# EAGLE design ssdf (EAGLE 9.5.2)
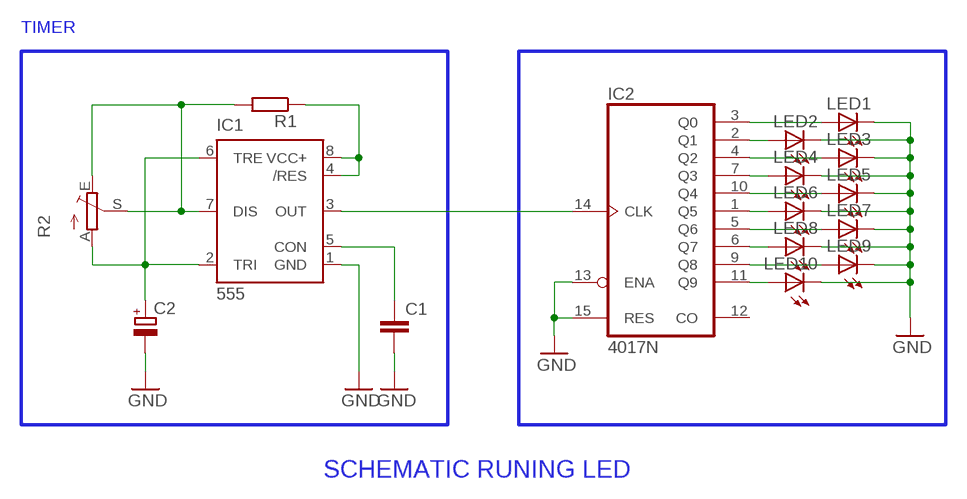
[diagram p0: schematic, sheet 1]

## Parts
C1  C-EU050-025X075  [C050-025X075]
C2  CPOL-EUE2-5  [E2-5]
IC1  555  555KIT  [DIP08-KIT]
IC2  4017N  [DIL16]
LED1  LED3MM  [LED3MM]
LED2  LED3MM  [LED3MM]
LED3  LED3MM  [LED3MM]
LED4  LED3MM  [LED3MM]
LED5  LED3MM  [LED3MM]
LED6  LED3MM  [LED3MM]
LED7  LED3MM  [LED3MM]
LED8  LED3MM  [LED3MM]
LED9  LED3MM  [LED3MM]
LED10  LED3MM  [LED3MM]
R1  R-EU_0204/7  [0204/7]
R2  TRIM_EU-B25P  [B25P]

## Nets
GND: C1.2 C2.- IC1.1(GND) IC2.13(ENA) IC2.15(RES) LED1.K(C) LED2.K(C) LED3.K(C) LED4.K(C) LED5.K(C) LED6.K(C) LED7.K(C) LED8.K(C) LED9.K(C) LED10.K(C)
N$1: C2.+ IC1.2(TRI) IC1.6(TRE) R2.A
N$2: C1.1 IC1.5(CON)
N$3: IC1.4(/RES) IC1.8(VCC+) R1.1
N$4: IC1.7(DIS) R1.2 R2.E R2.S
N$5: IC2.3(Q0) LED1.A
N$6: IC2.2(Q1) LED2.A
N$7: IC2.4(Q2) LED3.A
N$8: IC2.7(Q3) LED4.A
N$9: IC2.10(Q4) LED5.A
N$10: IC2.1(Q5) LED6.A
N$11: IC2.5(Q6) LED7.A
N$12: IC2.6(Q7) LED8.A
N$13: IC2.9(Q8) LED9.A
N$14: IC2.11(Q9) LED10.A
N$15: IC1.3(OUT) IC2.14(CLK)
Unconnected: IC2.12(CO)

## Notes on the sheet
- TIMER
- SCHEMATIC RUNING LED

## Power pins joined to a net without a drawn wire
VDD: IC2.16(VDD)
VSS: IC2.8(VSS)

## Library data of the parts
C1 = rcl:C-EU: CAPACITOR, European symbol; SPICEPREFIX: C
C2 = rcl:CPOL-EU: POLARIZED CAPACITOR, European symbol; SPICEPREFIX: C
IC1 = SparkFun-IC-Special-Function:555: General purpose bipolar Timer Datasheet <http://www.sparkfun.com/datasheets/Components/General/ne555.pdf> SparkFun Products SparkFun SparkPunk Sequencer Kit <https://www.sparkfun.com/products/12707> (KIT-12707) Storefront Component: 555 Timer <https://www.sparkfun.com/products/9273> (COM-09273) Two parts valid for production: VFP: IC-11930 (M7555 PTH) VFP: IC-09173 (555 PTH) - Preferred; PROD_ID: IC-09173; PROD_ID_ALT: IC-11930
IC2 = 40xx:4017: COUNTER/DIVIDER
LED1-LED10 = adafruit:LED: LED OSRAM: - CHIPLED LG R971, LG N971, LY N971, LG Q971, LY Q971, LO R971, LY R971 LH N974, LH R974 LS Q976, LO Q976, LY Q976 LO Q996 - Hyper CHIPLED LW Q18S LB Q993, LB Q99A, LB R99A - SideLED LS A670, LO A670, LY A670, LG A670, LP A670 LB A673, LV A673, LT A673, LW A673 LH A674 LY A675 LS A676, LA A676, LO A676, LY A676, LW A676 LS A679, LY A679, LG A679 - Hyper Micro SIDELED® LS Y876, LA Y876, LO Y876, LY Y876 LT Y87S - SmartLED LW L88C, LW L88S LB L89C, LB L89S, LG L890 LS L89K, LO L89K, LY L89K LS L896, LA L896, LO L896, LY L896 - TOPLED LS T670, LO T670, LY T670, LG T670, LP T670 LSG T670, LSP T670, LSY T670, LOP T670, LYG T670 LG T671, LOG T671, LSG T671 LB T673, LV T673, LT T673, LW T673 LH T674 LS T676, LA T676, LO T676, LY T676, LB T676, LH T676, LSB T676, LW T676 LB T67C, LV T67C, LT T67C, LS T67K, LO T67K, LY T67K, LW E67C LS E67B, LA E67B, LO E67B, LY E67B, LB E67C, LV E67C, LT E67C LW T67C LS T679, LY T679, LG T679 LS T770, LO T770, LY T770, LG T770, LP T770 LB T773, LV T773, LT T773, LW T773 LH T774 LS E675, LA E675, LY E675, LS T675 LS T776, LA T776, LO T776, LY T776, LB T776 LHGB T686 LT T68C, LB T68C - Hyper Mini TOPLED® LB M676 - Mini TOPLED Santana® LG M470 LS M47K, LO M47K, LY M47K Source: http://www.osram.convergy.de/
R1 = rcl:R-EU_: RESISTOR, European symbol; SPICEPREFIX: R
R2 = pot:TRIM_EU-: POTENTIOMETER

## Board
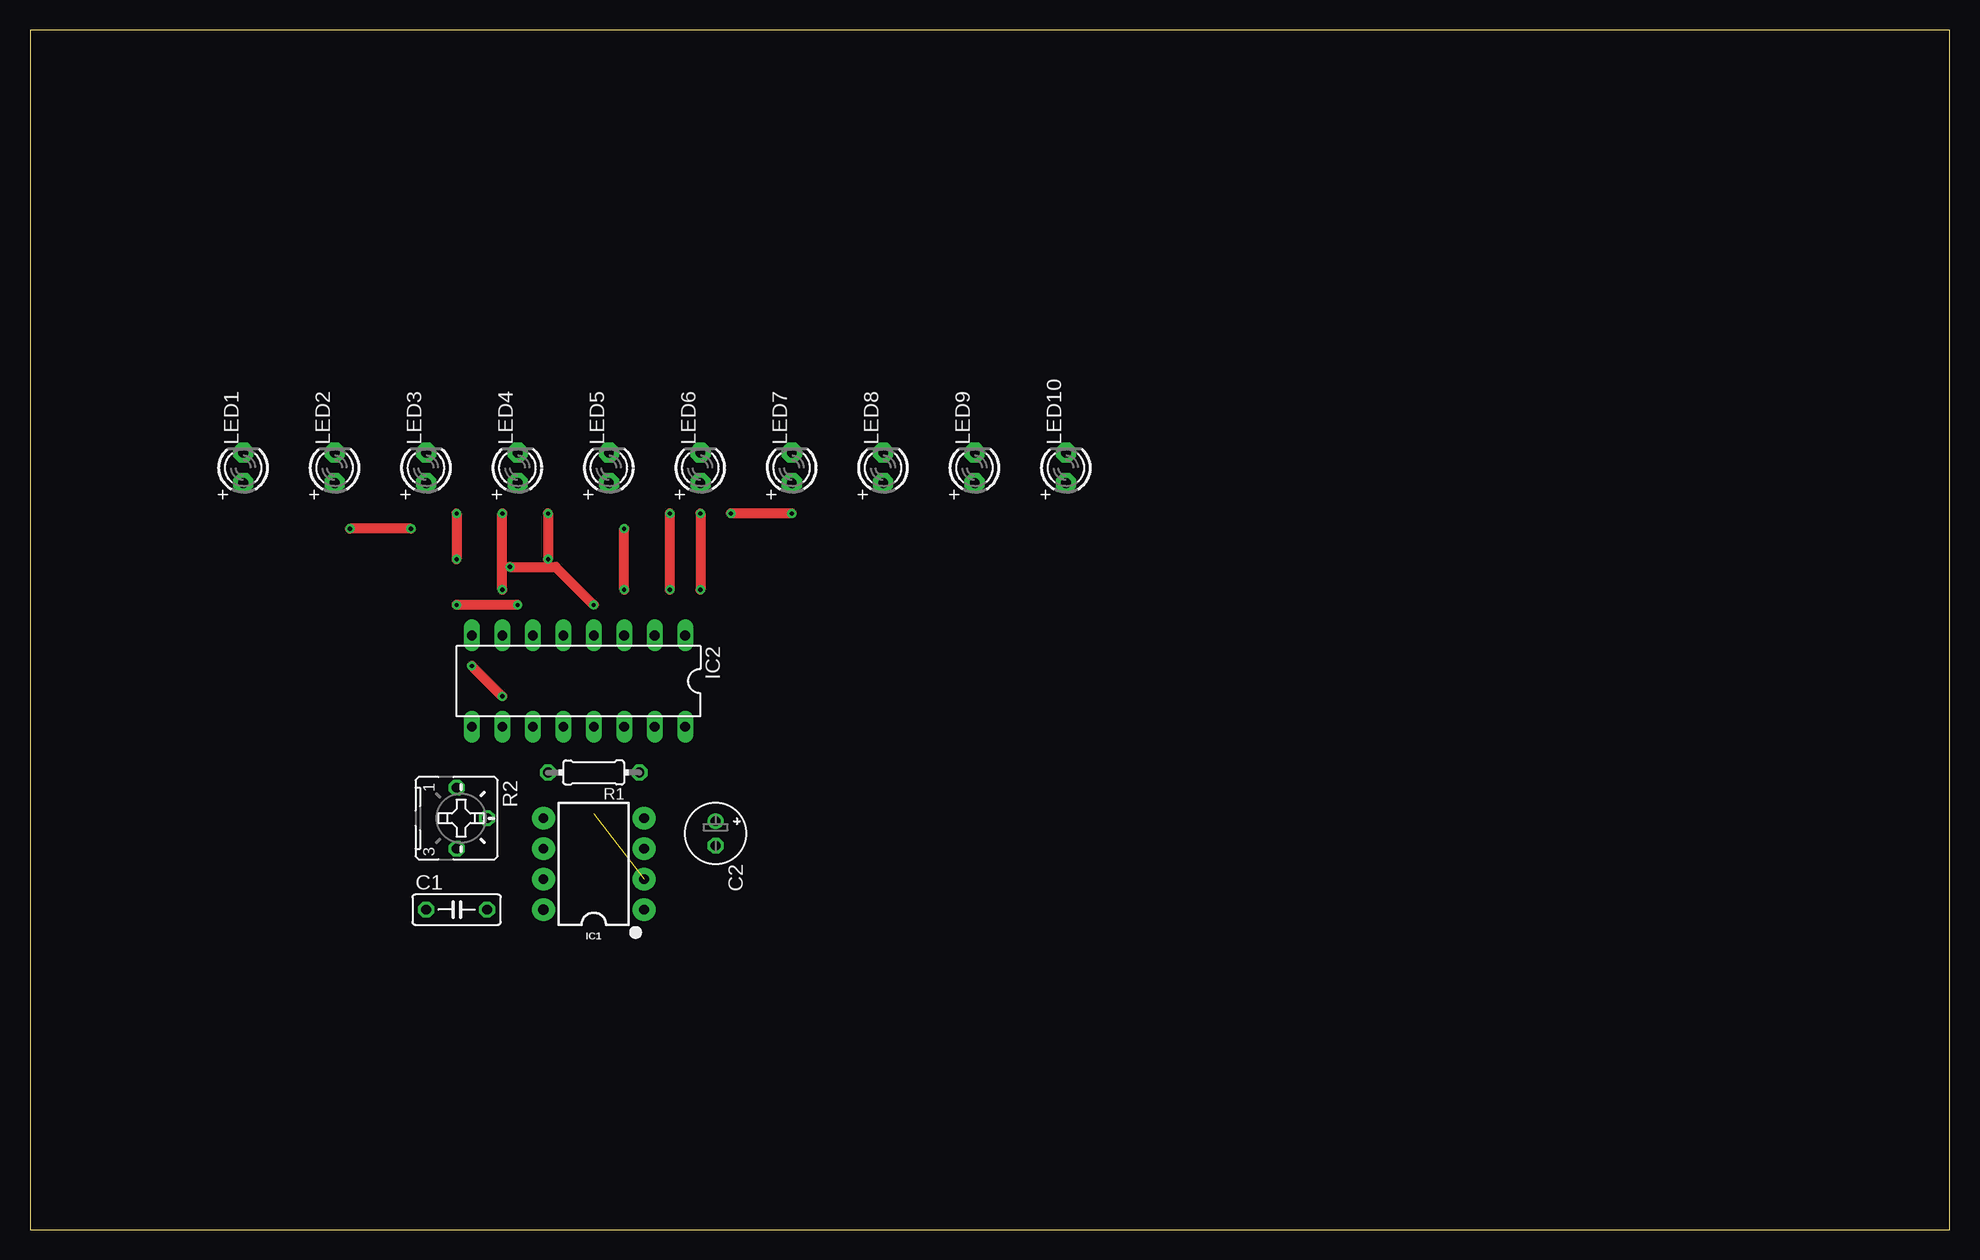
[diagram p1: board, top side]
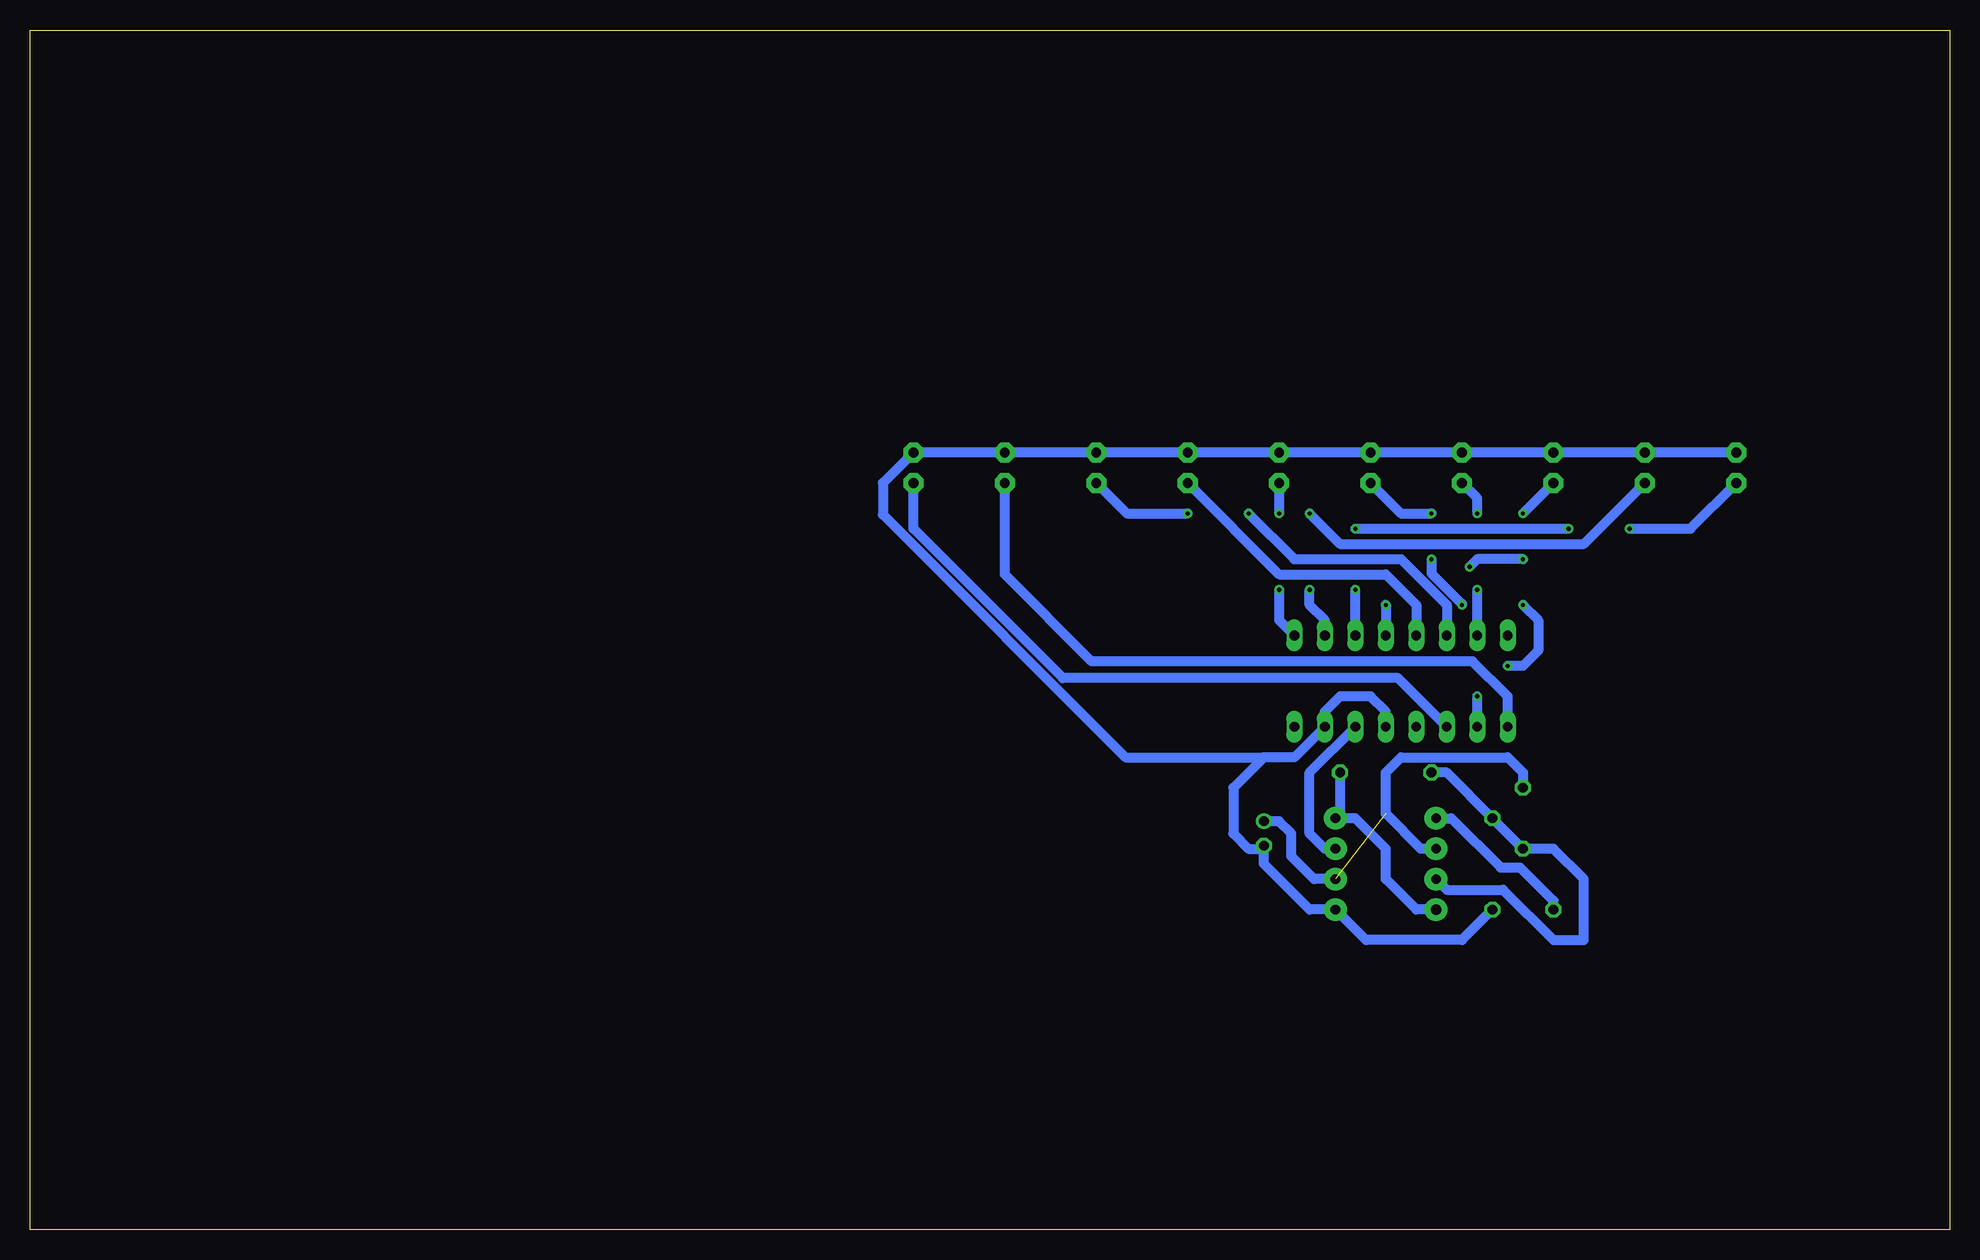
[diagram p2: board, bottom side, seen from below]

Size 160 x 100 mm. Coordinates in mm from the lower left corner, seen from the top.
Outline: 0,0 160,0 160,100 0,100 0,0
Copper layers (1*16): Top 0.035mm / dielectric 1.5mm / Bottom 0.035mm
Design rules "default": minimum track width 6mil, minimum drill 0.35mm, track to track 6mil, track to pad 6mil, pad to pad 6mil, via to via 6mil, smd to smd 6mil, copper to edge 40mil, drill to drill 6mil, minimum pad ring 10mil, minimum via ring 8mil, stop-mask expansion 4mil, vias tented up to drill 0mil, thermal gap 10mil

### Footprints (pad centres in the part's own frame; a part is rotated, then mirrored left to right if it is on the bottom)
C050-025X075 = drill 0.813 octagon: 1 -2.54,0; 2 2.54,0
E2-5 = drill 0.813 pad 1.27: + -1.016,0 | drill 0.813 pad 1.27 octagon: - 1.016,0
DIP08-KIT = drill 0.813 pad 1.905: 1 -3.81,-4.191; 2 -1.27,-4.191; 3 1.27,-4.191; 4 3.81,-4.191; 5 3.81,4.191; 6 1.27,4.191; 7 -1.27,4.191 | drill 0.864 pad 1.905: 8 -3.81,4.191
DIL16 = drill 0.813 long: 1 -8.89,-3.81; 2 -6.35,-3.81; 3 -3.81,-3.81; 4 -1.27,-3.81; 5 1.27,-3.81; 6 3.81,-3.81; 7 6.35,-3.81; 8 8.89,-3.81; 9 8.89,3.81; 10 6.35,3.81; 11 3.81,3.81; 12 1.27,3.81; 13 -1.27,3.81; 14 -3.81,3.81; 15 -6.35,3.81; 16 -8.89,3.81
LED3MM = drill 0.813 pad 1.676 octagon: A -1.27,0; K 1.27,0
0204/7 = drill 0.813 octagon: 1 -3.81,0; 2 3.81,0
B25P = drill 0.813 octagon: A -2.54,0; E 2.54,0; S 0,2.54

### Placement (x,y rotation side)
C1  35.56,26.67 0 top
C2  57.15,33.02 270 top
IC1  46.99,30.48 90 top
IC2  45.72,45.72 180 top
LED1  17.78,63.5 90 top
LED2  25.4,63.5 90 top
LED3  33.02,63.5 90 top
LED4  40.64,63.5 90 top
LED5  48.26,63.5 90 top
LED6  55.88,63.5 90 top
LED7  63.5,63.5 90 top
LED8  71.12,63.5 90 top
LED9  78.74,63.5 90 top
LED10  86.36,63.5 90 top
R1  46.99,38.1 180 top
R2  35.56,34.29 270 top

### Tracks (layer width: path | path; a pad name or v marks a point on that pad's centre or on a via)
GND
  Bottom 0.813: C1.2 40.64,24.13 48.64,24.13 IC1.1 53.34,26.67 57.15,30.48 C2.- 57.4,31.75 58.42,31.75 59.69,33.02 59.69,36.83 57.15,39.37 | LED1.K LED2.K LED3.K LED4.K LED5.K LED6.K LED7.K LED8.K LED9.K LED10.K 88.9,62.23 88.9,59.59 68.67,39.37 57.15,39.37 | IC2.13 46.99,43.18 48.26,44.45 50.8,44.45 52.07,43.18 IC2.15 54.61,39.37 57.15,39.37
N$1  (1 unrouted)
  Bottom 0.813: IC1.2 52.96,29.21 54.86,31.11 54.86,33.02 55.88,34.04 C2.+ | IC1.6 44.07,31.75 46.99,34.67 46.99,38.1 45.72,39.37 36.83,39.37 35.56,38.1 R2.A
N$2
  Bottom 0.813: IC1.5 41.53,34.29 37.41,30.18 35.8,30.18 33.02,27.4 C1.1
N$3
  Bottom 0.813: IC1.8 44.45,26.67 46.99,29.21 46.99,31.75 49.53,34.29 50.8,34.29 | 50.8,34.29 IC1.4 | R1.1 50.8,34.29
N$4
  Bottom 0.813: R1.2 41.91,38.1 R2.S R2.E 33.02,31.75 30.48,29.21 30.48,24.13 33.02,24.13 37.21,28.32 41.91,28.32 IC1.7
N$5  (via drill 0.35)
  Top 0.813: v49.53,53.34 v49.53,58.42 | v31.75,58.42 v26.67,58.42
  Bottom 0.813: IC2.3 v49.53,53.34 | v49.53,58.42 v31.75,58.42 | v26.67,58.42 21.59,58.42 LED1.A
N$6  (via drill 0.35)
  Top 0.813: v53.34,53.34 v53.34,59.69
  Bottom 0.813: IC2.2 52.07,50.8 53.34,52.07 v53.34,53.34 | v53.34,59.69 50.8,57.15 30.48,57.15 LED2.A
N$7  (via drill 0.35)
  Top 0.813: v35.56,59.69 v35.56,55.88 | v40.01,55.24 43.81,55.24 v46.99,52.07
  Bottom 0.813: LED3.A v35.56,59.69 | v35.56,55.88 39.37,55.88 v40.01,55.24 | v46.99,52.07 IC2.4
N$8  (via drill 0.35)
  Top 0.813: v39.37,53.34 v39.37,59.69
  Bottom 0.813: IC2.7 v39.37,53.34 | v39.37,59.69 39.37,60.96 LED4.A
N$9  (via drill 0.35)
  Top 0.813: v39.37,44.45 v36.83,46.99 | v43.18,59.69 v43.18,55.88 | v40.64,52.07 v35.56,52.07
  Bottom 0.813: IC2.10 v39.37,44.45 | LED5.A 45.72,59.69 v43.18,59.69 | v43.18,55.88 43.18,54.7 40.64,52.16 v40.64,52.07 | v35.56,52.07 34.29,50.8 34.29,48.26 35.56,46.99 v36.83,46.99
N$10  (via drill 0.35)
  Top 0.813: v55.88,59.69 v55.88,53.34
  Bottom 0.813: LED6.A v55.88,59.69 | v55.88,53.34 55.88,50.8 IC2.1
N$11
  Bottom 0.813: LED7.A 55.88,54.61 46.99,54.61 44.45,52.07 IC2.5
N$12  (via drill 0.35)
  Top 0.813: v63.5,59.69 v58.42,59.69
  Bottom 0.813: LED8.A 68.58,59.69 v63.5,59.69 | v58.42,59.69 54.61,55.88 45.72,55.88 41.91,52.07 IC2.6
N$13
  Bottom 0.813: IC2.9 36.83,44.45 39.75,47.37 71.5,47.37 78.74,54.61 LED9.A
N$14
  Bottom 0.813: IC2.11 45.97,45.97 73.91,45.97 86.36,58.42 LED10.A
N$15
  Bottom 0.813: IC1.3 52.07,31.75 53.34,33.02 53.34,38.1 IC2.14